# Altium schematic sheet Turbidity.SchDoc
size A4
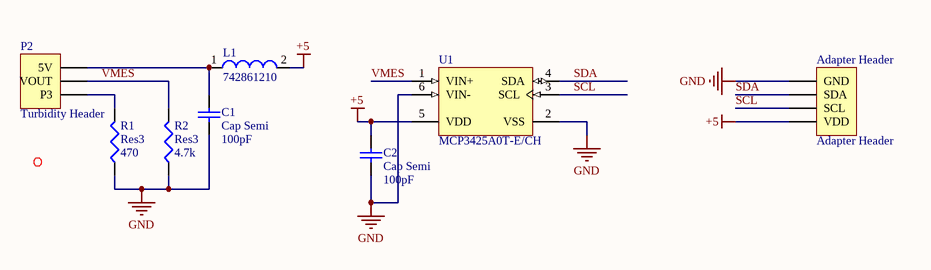
[diagram p0: Turbidity.SchDoc]

## Parts
Adapter_Header  Adapter Header  [Adapter Header]
C1  Cap Semi  value 100pF  [1608[0603]]
C2  Cap Semi  value 100pF  [1608[0603]]
L1  742861210  [SMD-0603]
M  mounting hole  [MOUNTING_HOLE]  (value not drawn)
P2  Turbidity Header  [TURBIDITY HEADER]
R1  Res3  value 470  [J1-0603]
R2  Res3  value 4.7k  [J1-0603]
U1  MCP3425A0T-E/CH  [SOT-23-CH6_M]

## Nets
+5: Adapter_Header.4(VDD) C2.2 L1.2 U1.5(VDD)
GND: Adapter_Header.1(GND) C1.1 C2.1 R1.1 R2.1 U1.2(VSS) U1.6(VIN-)
SCL: Adapter_Header.3(SCL) U1.3(SCL)
SDA: Adapter_Header.2(SDA) U1.4(SDA)
VMES: P2.2(VOUT) R2.2 U1.1(VIN+)
NetC1_2: C1.2 L1.1 P2.3(5V)
NetP2_1: P2.1(P3) R1.2

## Library data of the parts
Adapter_Header = Adapter Header: Header, 4-Pin; LatestRevisionDate: 17-Jul-2002; LatestRevisionNote: Re-released for DXP Platform.; Publisher: Altium Limited
C1 C2 = Cap Semi: Capacitor (Semiconductor SIM Model); Published: 8-Jun-2000; LatestRevisionDate: 29-May-2009; LatestRevisionNote: IPC-7351 Footprint Added.; PackageReference: C1206; Publisher: Altium Limited; PackageDescription: Chip Capacitor
L1 = CMP-0220-00121-1: SMD EMI Suppression Ferrite Bead WE-CBF HF, Z = 1000 Ohm; PackageDescription: Chip Inductor, 2-Leads, Body 1.6 x 0.8 mm; PackageReference: SMD-0603; DatasheetVersion: ver 2, Aug-2009; ComponentLink2Description: Datasheet; ComponentLink1Description: Manufacturer Link; Impedance: 1000 Ohm; PackageVersion: 2009; ComponentLink2URL: http://www.we-online.de/katalog/media/pdf/742861210.pdf; ComponentLink1URL: http://www.we-online.com
M = mounting_hole
P2 = Turbidity Header: Header, 3-Pin; LatestRevisionDate: 17-Jul-2002; LatestRevisionNote: Re-released for DXP Platform.; Publisher: Altium Limited
R1 R2 = Res3: Resistor; Published: 8-Jun-2000; LatestRevisionDate: 29-May-2009; LatestRevisionNote: IPC-7351 Footprint Added.; PackageReference: J1-0603; Publisher: Altium Limited; PackageDescription: Chip Resistor
U1 = CMP-0188-00774-2: 16-Bit Analog-to-Digital Converter with I2C Interface and On-Board Reference, 6-Pin SOT-23, Extended Temperature, Tape and Reel; ComponentLink2URL: http://ww1.microchip.com/downloads/en/DeviceDoc/22072b.pdf; RevisionNote: URLs added.; ComponentLink1Description: Manufacturer URL; DatasheetVersion: revB, Aug-2009; ComponentLink2Description: Datasheet; ComponentLink3URL: http://www.microchip.com/stellent/groups/techpub_sg/documents/packagingspec/en012702.pdf; PackageReference: SOT-23-CH6; ComponentLink3Description: Package Specification; PackageVersion: revBB, Aug-2009; ComponentLink1URL: http://www.microchip.com/; PackageDescription: 6-Lead Plastic Small Outline Transistor (CH) [SOT-23]; Code_IPC: SOT26A-6